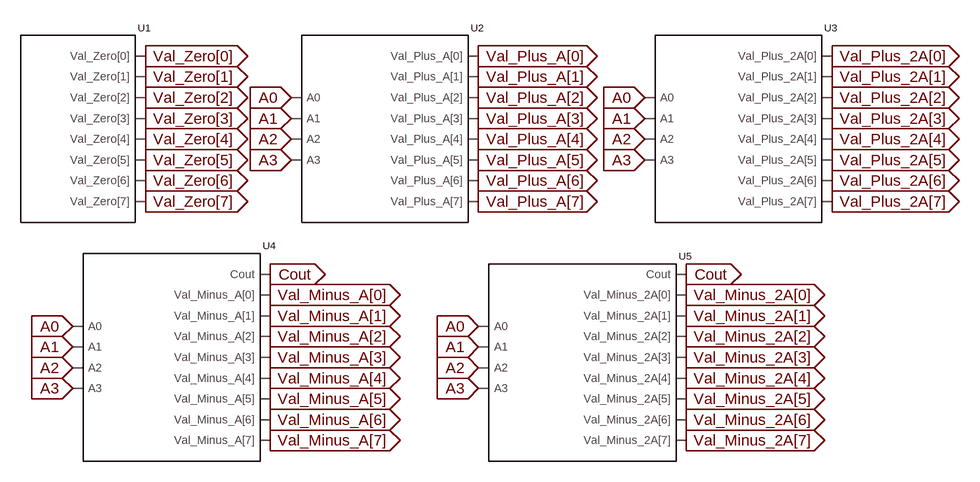
[diagram p0: schematic MMG_Block.asc]
MMG_Block.asc, the LTspice schematic file:
Version 4
SHEET 1 1332 1640
WIRE -16 -96 -32 -96
WIRE 496 -96 480 -96
WIRE 1040 -96 1024 -96
WIRE -16 -64 -32 -64
WIRE 496 -64 480 -64
WIRE 1040 -64 1024 -64
WIRE -16 -32 -32 -32
WIRE 224 -32 208 -32
WIRE 496 -32 480 -32
WIRE 768 -32 752 -32
WIRE 1040 -32 1024 -32
WIRE -16 0 -32 0
WIRE 224 0 208 0
WIRE 496 0 480 0
WIRE 768 0 752 0
WIRE 1040 0 1024 0
WIRE -16 32 -32 32
WIRE 224 32 208 32
WIRE 496 32 480 32
WIRE 768 32 752 32
WIRE 1040 32 1024 32
WIRE -16 64 -32 64
WIRE 224 64 208 64
WIRE 496 64 480 64
WIRE 768 64 752 64
WIRE 1040 64 1024 64
WIRE -16 96 -32 96
WIRE 496 96 480 96
WIRE 1040 96 1024 96
WIRE -16 128 -32 128
WIRE 496 128 480 128
WIRE 1040 128 1024 128
WIRE 176 240 160 240
WIRE 816 240 800 240
WIRE 176 272 160 272
WIRE 816 272 800 272
WIRE 176 304 160 304
WIRE 816 304 800 304
WIRE -112 320 -128 320
WIRE 512 320 496 320
WIRE 176 336 160 336
WIRE 816 336 800 336
WIRE -112 352 -128 352
WIRE 512 352 496 352
WIRE 176 368 160 368
WIRE 816 368 800 368
WIRE -112 384 -128 384
WIRE 512 384 496 384
WIRE 176 400 160 400
WIRE 816 400 800 400
WIRE -112 416 -128 416
WIRE 512 416 496 416
WIRE 176 432 160 432
WIRE 816 432 800 432
WIRE 176 464 160 464
WIRE 816 464 800 464
WIRE 176 496 160 496
WIRE 816 496 800 496
FLAG -16 -96 Val_Zero[0]
IOPIN -16 -96 Out
FLAG -16 -64 Val_Zero[1]
IOPIN -16 -64 Out
FLAG -16 -32 Val_Zero[2]
IOPIN -16 -32 Out
FLAG -16 0 Val_Zero[3]
IOPIN -16 0 Out
FLAG -16 32 Val_Zero[4]
IOPIN -16 32 Out
FLAG -16 64 Val_Zero[5]
IOPIN -16 64 Out
FLAG -16 96 Val_Zero[6]
IOPIN -16 96 Out
FLAG -16 128 Val_Zero[7]
IOPIN -16 128 Out
FLAG 208 -32 A0
IOPIN 208 -32 In
FLAG 208 0 A1
IOPIN 208 0 In
FLAG 208 32 A2
IOPIN 208 32 In
FLAG 208 64 A3
IOPIN 208 64 In
FLAG 752 -32 A0
IOPIN 752 -32 In
FLAG 752 0 A1
IOPIN 752 0 In
FLAG 752 32 A2
IOPIN 752 32 In
FLAG 752 64 A3
IOPIN 752 64 In
FLAG -128 320 A0
IOPIN -128 320 In
FLAG -128 352 A1
IOPIN -128 352 In
FLAG -128 384 A2
IOPIN -128 384 In
FLAG -128 416 A3
IOPIN -128 416 In
FLAG 496 320 A0
IOPIN 496 320 In
FLAG 496 352 A1
IOPIN 496 352 In
FLAG 496 384 A2
IOPIN 496 384 In
FLAG 496 416 A3
IOPIN 496 416 In
FLAG 496 -96 Val_Plus_A[0]
IOPIN 496 -96 Out
FLAG 496 -64 Val_Plus_A[1]
IOPIN 496 -64 Out
FLAG 496 -32 Val_Plus_A[2]
IOPIN 496 -32 Out
FLAG 496 0 Val_Plus_A[3]
IOPIN 496 0 Out
FLAG 496 32 Val_Plus_A[4]
IOPIN 496 32 Out
FLAG 496 64 Val_Plus_A[5]
IOPIN 496 64 Out
FLAG 496 96 Val_Plus_A[6]
IOPIN 496 96 Out
FLAG 496 128 Val_Plus_A[7]
IOPIN 496 128 Out
FLAG 1040 -96 Val_Plus_2A[0]
IOPIN 1040 -96 Out
FLAG 1040 -64 Val_Plus_2A[1]
IOPIN 1040 -64 Out
FLAG 1040 -32 Val_Plus_2A[2]
IOPIN 1040 -32 Out
FLAG 1040 0 Val_Plus_2A[3]
IOPIN 1040 0 Out
FLAG 1040 32 Val_Plus_2A[4]
IOPIN 1040 32 Out
FLAG 1040 64 Val_Plus_2A[5]
IOPIN 1040 64 Out
FLAG 1040 96 Val_Plus_2A[6]
IOPIN 1040 96 Out
FLAG 1040 128 Val_Plus_2A[7]
IOPIN 1040 128 Out
FLAG 176 240 Cout
IOPIN 176 240 Out
FLAG 176 272 Val_Minus_A[0]
IOPIN 176 272 Out
FLAG 176 304 Val_Minus_A[1]
IOPIN 176 304 Out
FLAG 176 336 Val_Minus_A[2]
IOPIN 176 336 Out
FLAG 176 368 Val_Minus_A[3]
IOPIN 176 368 Out
FLAG 176 400 Val_Minus_A[4]
IOPIN 176 400 Out
FLAG 176 432 Val_Minus_A[5]
IOPIN 176 432 Out
FLAG 176 464 Val_Minus_A[6]
IOPIN 176 464 Out
FLAG 176 496 Val_Minus_A[7]
IOPIN 176 496 Out
FLAG 816 240 Cout
IOPIN 816 240 Out
FLAG 816 272 Val_Minus_2A[0]
IOPIN 816 272 Out
FLAG 816 304 Val_Minus_2A[1]
IOPIN 816 304 Out
FLAG 816 336 Val_Minus_2A[2]
IOPIN 816 336 Out
FLAG 816 368 Val_Minus_2A[3]
IOPIN 816 368 Out
FLAG 816 400 Val_Minus_2A[4]
IOPIN 816 400 Out
FLAG 816 432 Val_Minus_2A[5]
IOPIN 816 432 Out
FLAG 816 464 Val_Minus_2A[6]
IOPIN 816 464 Out
FLAG 816 496 Val_Minus_2A[7]
IOPIN 816 496 Out
SYMBOL Val_Zero -48 -32 R0
SYMATTR InstName U1
SYMBOL Val_Plus_A 336 -16 R0
SYMATTR InstName U2
SYMBOL Val_Plus_2A 848 16 R0
SYMATTR InstName U3
SYMBOL Val_Minus_A -32 384 R0
SYMATTR InstName U4
SYMBOL Val_Minus_2A 576 416 R0
SYMATTR InstName U5

The netlist it stands for:
* MMG_Block.asc
XU1 Val_Zero[0] Val_Zero[1] Val_Zero[2] Val_Zero[3] Val_Zero[4] Val_Zero[5] Val_Zero[6] Val_Zero[7] Val_Zero  ; pins Val_Zero[0] Val_Zero[1] Val_Zero[2] Val_Zero[3] Val_Zero[4] Val_Zero[5] Val_Zero[6] Val_Zero[7]
XU2 A0 A1 A2 A3 Val_Plus_A[0] Val_Plus_A[1] Val_Plus_A[2] Val_Plus_A[3] Val_Plus_A[4] Val_Plus_A[5] Val_Plus_A[6] Val_Plus_A[7] Val_Plus_A  ; pins A0 A1 A2 A3 Val_Plus_A[0] Val_Plus_A[1] Val_Plus_A[2] Val_Plus_A[3] Val_Plus_A[4] Val_Plus_A[5] Val_Plus_A[6] Val_Plus_A[7]
XU3 A0 A1 A2 A3 Val_Plus_2A[0] Val_Plus_2A[1] Val_Plus_2A[2] Val_Plus_2A[3] Val_Plus_2A[4] Val_Plus_2A[5] Val_Plus_2A[6] Val_Plus_2A[7] Val_Plus_2A  ; pins A0 A1 A2 A3 Val_Plus_2A[0] Val_Plus_2A[1] Val_Plus_2A[2] Val_Plus_2A[3] Val_Plus_2A[4] Val_Plus_2A[5] Val_Plus_2A[6] Val_Plus_2A[7]
XU4 A0 A1 A2 A3 Cout Val_Minus_A[0] Val_Minus_A[1] Val_Minus_A[2] Val_Minus_A[3] Val_Minus_A[4] Val_Minus_A[5] Val_Minus_A[6] Val_Minus_A[7] Val_Minus_A  ; pins A0 A1 A2 A3 Cout Val_Minus_A[0] Val_Minus_A[1] Val_Minus_A[2] Val_Minus_A[3] Val_Minus_A[4] Val_Minus_A[5] Val_Minus_A[6] Val_Minus_A[7]
XU5 A0 A1 A2 A3 Cout Val_Minus_2A[0] Val_Minus_2A[1] Val_Minus_2A[2] Val_Minus_2A[3] Val_Minus_2A[4] Val_Minus_2A[5] Val_Minus_2A[6] Val_Minus_2A[7] Val_Minus_2A  ; pins A0 A1 A2 A3 Cout Val_Minus_2A[0] Val_Minus_2A[1] Val_Minus_2A[2] Val_Minus_2A[3] Val_Minus_2A[4] Val_Minus_2A[5] Val_Minus_2A[6] Val_Minus_2A[7]
.lib Val_Zero.sub
.lib Val_Plus_A.sub
.lib Val_Plus_2A.sub
.lib Val_Minus_A.sub
.lib Val_Minus_2A.sub
.backanno
.end